# Altium schematic sheet Harvester.SchDoc
size A4
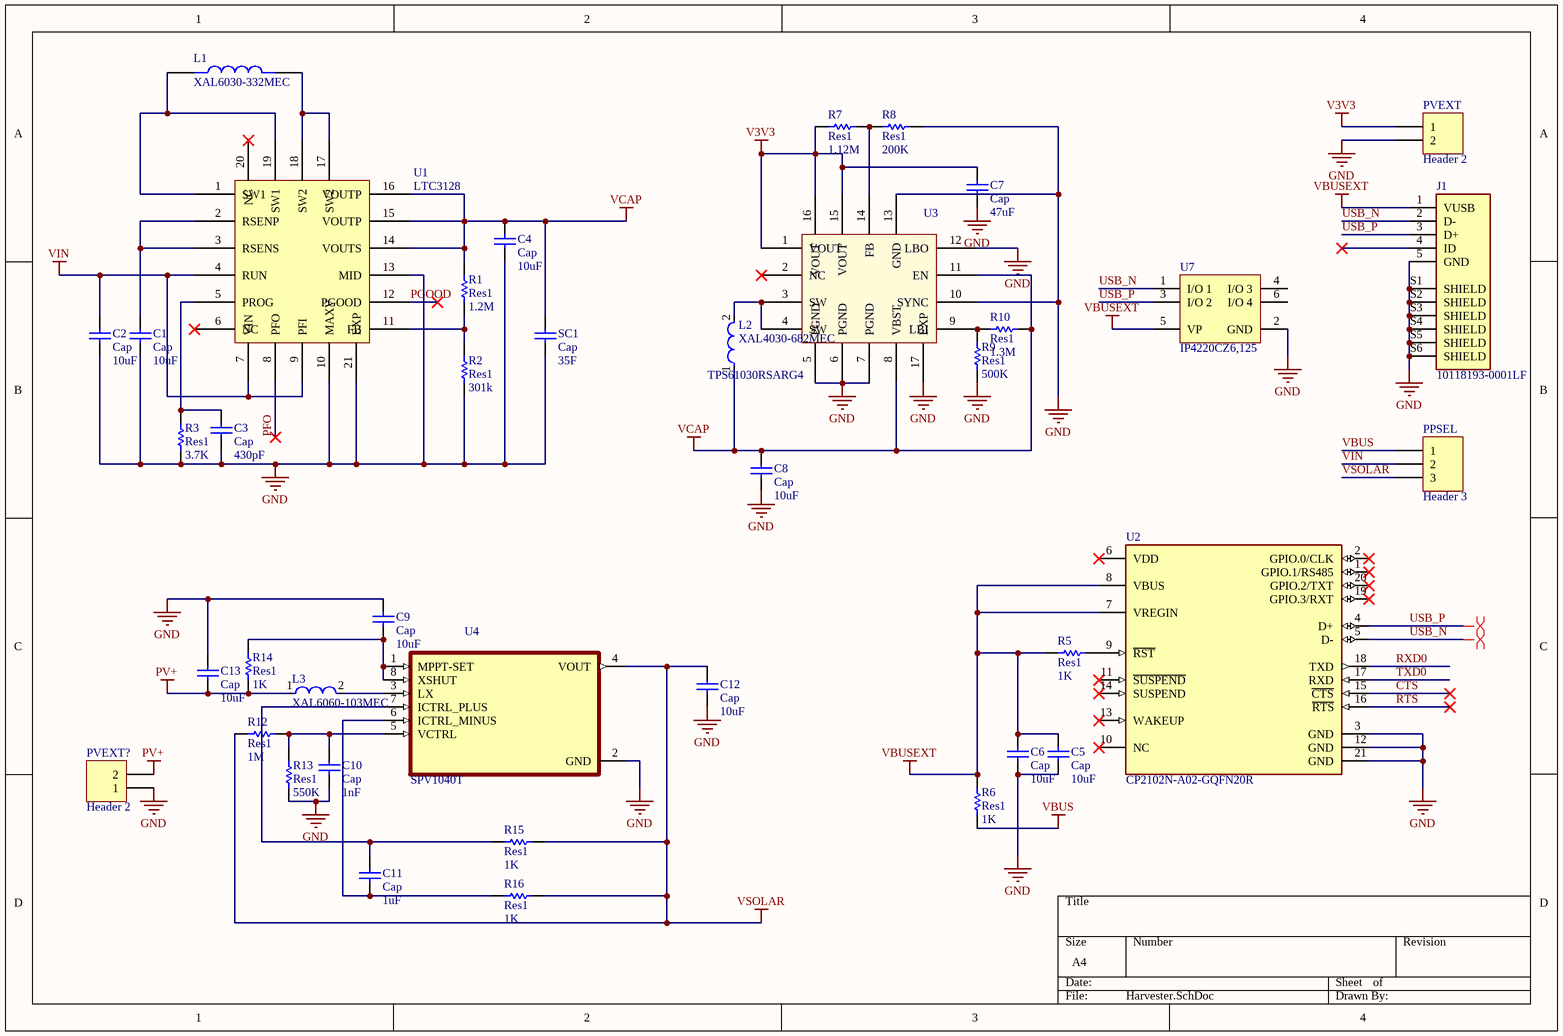
[diagram p0: Harvester.SchDoc]

## Parts
C1  Cap  value 10uF  [1608[0603]]
C2  Cap  value 10uF  [1608[0603]]
C3  Cap  value 430pF  [1608[0603]]
C4  Cap  value 10uF  [1608[0603]]
C5  Cap  value 10uF  [1608[0603]]
C6  Cap  value 10uF  [1608[0603]]
C7  Cap  value 47uF  [1812]
C8  Cap  value 10uF  [1608[0603]]
C9  Cap  value 10uF  [1608[0603]]
C10  Cap  value 1nF  [1608[0603]]
C11  Cap  value 1uF  [1608[0603]]
C12  Cap  value 10uF  [1608[0603]]
C13  Cap  value 10uF  [1608[0603]]
J1  10118193-0001LF  [FCI_10118193-0001LF]
L1  XAL6030-332MEC  [IND_XAL6030-332MEC]
L2  XAL4030-682MEC  [FP-XAL4030-472MEC-MFG]
L3  XAL6060-103MEC  [FP-XAL6060-103MEC-MFG]
PPSEL  Header 3  [HDR1X3]
PVEXT  Header 2  [HDR1X2]
PVEXT?  Header 2  [HDR1X2]
R1  Res1  value 1.2M  [0603R-GENERIC]
R2  Res1  value 301k  [0603R-GENERIC]
R3  Res1  value 3.7K  [0603R-GENERIC]
R5  Res1  value 1K  [0603R-GENERIC]
R6  Res1  value 1K  [0603R-GENERIC]
R7  Res1  value 1.12M  [0603R-GENERIC]
R8  Res1  value 200K  [0603R-GENERIC]
R9  Res1  value 500K  [0603R-GENERIC]
R10  Res1  value 1.3M  [0603R-GENERIC]
R12  Res1  value 1M  [0603R-GENERIC]
R13  Res1  value 550K  [0603R-GENERIC]
R14  Res1  value 1K  [0603R-GENERIC]
R15  Res1  value 1K  [0603R-GENERIC]
R16  Res1  value 1K  [0603R-GENERIC]
SC1  Cap  value 35F  [RAD-0.3]
U1  LTC3128  [QFN50P400X500X80-21N]
U2  CP2102N-A02-GQFN20R  [FP-CP2102N-A02-GQFN20R-MFG]
U3  TPS61030RSARG4  [QFN65P400X400X100-17N]
U4  SPV1040T  [SOP65P640X120-8N]
U7  IP4220CZ6,125  [NXP-SOT457_L]

## Nets
GND: C1.1 C2.1 C3.1 C4.1 C5.1 C6.1 C7.1 C8.1 C9.2 C10.1 C12.1 C13.2 J1.5(GND) J1.S1(SHIELD) J1.S2(SHIELD) J1.S3(SHIELD) J1.S4(SHIELD) J1.S5(SHIELD) J1.S6(SHIELD) PVEXT.2 PVEXT?.1 R2.2 R3.1 R8.1 R9.2 R13.1 SC1.1 U1.10(MAXV) U1.13(MID) U1.21(EXP) U2.3(GND) U2.12(GND) U2.21(GND) U3.5(PGND) U3.6(PGND) U3.7(PGND) U3.10(SYNC) U3.12(LBO) U3.13(GND) U3.17(EXP) U4.2(GND) U7.2(GND)
PV+: C13.1 L3.1 PVEXT?.2 R14.1
V3V3: C7.2 PVEXT.1 R7.2 U3.1(VOUT) U3.15(VOUT) U3.16(VOUT)
VBUS: PPSEL.1 R6.1
VBUSEXT: C5.2 C6.2 J1.1(VUSB) R5.2 R6.2 U2.7(VREGIN) U2.8(VBUS) U7.5(VP)
VCAP: C4.2 C8.2 L2.1 R1.2 R10.2 SC1.2 U1.14(VOUTS) U1.15(VOUTP) U1.16(VOUTP) U3.8(VBST) U3.11(EN)
VIN: C2.2 PPSEL.2 U1.4(RUN) U1.7(VIN) U1.9(PFI)
VSOLAR: C12.2 PPSEL.3 R12.2 R15.1 R16.1 U4.4(VOUT)
CTS: U2.15(~{CTS})
PFO: U1.8(PFO)
PGOOD: U1.12(PGOOD)
RTS: U2.16(~{RTS})
RXD0: U2.18(TXD)
TXD0: U2.17(RXD)
USB_N: J1.2(D-) U2.5(D-) U7.1(I/O_1)
USB_P: J1.3(D+) U2.4(D+) U7.3(I/O_2)
NetC1_2: C1.2 U1.2(RSENP) U1.3(RSENS)
NetC3_2: C3.2 R3.2 U1.5(PROG)
NetC9_1: C9.1 R14.2 U4.1(MPPT-SET) U4.8(XSHUT)
NetC10_2: C10.2 R12.1 R13.2 U4.5(VCTRL)
NetC11_1: C11.1 R16.2 U4.6(ICTRL_MINUS)
NetC11_2: C11.2 R15.2 U4.7(ICTRL_PLUS)
NetL1_1: L1.1 U1.1(SW1) U1.19(SW1)
NetL1_2: L1.2 U1.17(SW2) U1.18(SW2)
NetL2_2: L2.2 U3.3(SW) U3.4(SW)
NetL3_2: L3.2 U4.3(LX)
NetR1_1: R1.1 R2.1 U1.11(FB)
NetR5_1: R5.1 U2.9(~{RST})
NetR7_1: R7.1 R8.2 U3.14(FB)
NetR9_1: R9.1 R10.1 U3.9(LBI)

Not connected (* = marked no-connect by the designer): J1 4(ID)*; U1 6(NC)* 20(NC)*; U2 1(GPIO.1/RS485)* 2(GPIO.0/CLK)* 6(VDD)* 10(NC)* 11(~{SUSPEND})* 13(WAKEUP)* 14(SUSPEND)* 19(GPIO.3/RXT)* 20(GPIO.2/TXT)*; U3 2(NC)*; U7 4(I/O_3) 6(I/O_4)

## Layout directives
differential pair: USB_N, USB_P

## Library data of the parts
C1-C13 SC1 = Cap: Capacitor; Published: 8-Jun-2000; LatestRevisionDate: 17-Jul-2002; LatestRevisionNote: Re-released for DXP Platform.; PackageReference: RAD-0.3; Publisher: Altium Limited; PackageDescription: Radial Cap, Thru-Hole; 2 Leads; 0.3 in Pin Spacing
J1 = 10118193-0001LF: USB - micro B USB 2.0 Receptacle Connector 5 Position Surface Mount, Right Angle; Through Hole; MF: Amphenol ICC; Availability: Unavailable; SnapEDA_Link: https://www.snapeda.com/parts/10118193-0001LF/Amphenol%20FCI/view-part/2758989/?ref=snap; MP: 10118193-0001LF; Price: None; Value: *; Package: None
L1 = XAL6030-332MEC: Power inductor, shielded, 20% tol, SMT, RoHS, halogen f; Package: None; Price: None; Value: *; MP: XAL6030-332MEC; Availability: Unavailable
L2 = CMP-11268-000082-1: Power Inductor (SMD), 6.8 µH, 5.1 A, Shielded, 4.5 A, XAL40xx Series, 4mm x 4mm x 3.1mm; Tolerance: 20%; DC Resistance (DCR): 44.1mR; Inductance: 4.7uH; Saturation Current: 4.5A; Max DC Current: 5.1A; Self Resonant Frequency: 36MHz; Test Frequency: 100kHz; Core Material: Composite; REACH SVHC: No SVHC; Height: 3.1mm; Package Quantity: 500; Width: 4.3mm; Mount: Surface Mount; RoHS Compliant: Yes; Case/Package: SMD/SMT; Length: 4.3mm; Packaging: Tape and Reel; Max Operating Temperature: 125°C; Min Operating Temperature: -40°C; Series: XAL4030; Termination: SMD/SMT; Inductance Tolerance: 20%; Shielding: Shielded; RMS Current (Irms): 5.1A; Lead Free: Contains Lead
L3 = CMP-11268-000089-1: - - Výkonový Induktor (SMD), 10 µH, 7 A, Stínený, 7.6 A, Série XAL6060, 6,56mm x 6,36mm x 6,1mm; Core Material: Composite; Inductance Tolerance: 20%; Saturation Current: 7.6A; Shielding: Shielded; Max DC Current: 7A; Inductance: 10uH; Test Frequency: 100kHz; Self Resonant Frequency: 14MHz; DC Resistance (DCR): 29.82mR; Package Quantity: 250; Min Operating Temperature: -40°C; Height: 6.1mm; Tolerance: 20%; Termination: SMD/SMT; Width: 6.56mm; Case/Package: SMD/SMT; Series: XAL6060; RoHS Compliant: Yes; Lead Free: Contains Lead; Max Operating Temperature: 125°C; Packaging: Tape and Reel; REACH SVHC: No SVHC; Mount: Surface Mount; RMS Current (Irms): 7A; Length: 6.76mm
PPSEL = Header 3: Header, 3-Pin; LatestRevisionDate: 17-Jul-2002; LatestRevisionNote: Re-released for DXP Platform.; Publisher: Altium Limited
PVEXT PVEXT? = Header 2: Header, 2-Pin; LatestRevisionDate: 17-Jul-2002; LatestRevisionNote: Re-released for DXP Platform.; Publisher: Altium Limited
R1-R3 R5-R10 R12-R16 = Res1: Resistor; Published: 8-Jun-2000; LatestRevisionDate: 17-Jul-2002; LatestRevisionNote: Re-released for DXP Platform.; PackageReference: AXIAL-0.3; Publisher: Altium Limited; PackageDescription: Axial Device, Thru-Hole; 2 Leads; 0.3 in Pin Spacing
U2 = CMP-08107-000007-1: IC USB TO UART BRIDGE QFN20
U4 = SPV1040T: IC BATTERY CHARGER SOLAR 8TSSOP; MF: STMicroelectronics; Package: TSSOP-8 STMicroelectronics; Availability: Unavailable; Value: *; MP: SPV1040T; SnapEDA_Link: https://www.snapeda.com/parts/SPV1040T/STMicroelectronics/view-part/480076/?ref=snap; Price: None
U7 = CMP-2000-06457-1: Dual USB 2.0 integrated ESD protection, 0 to 5.5 V, -40 to 85 degC, 6-Pin TSOP (SOT457), RoHS, Tape and Reel; Manufacturer: NXP Semiconductors; Product Height (mm): 1mm; Rad Hardened: No; Package Version: 06-03-16, 03/2006; Product Length (mm): 3.1mm; VIN Max: 5.5V; Configuration: Quad; Suppressor Type: DiodeArrays; Number of Channels: 4; VF: 0.7V; Capacitance Value: 1.2pF; Product Depth (mm): 1.7mm; VIN Min: 0V; Leakage Current (Max): 0.1uA; ESD Protection Voltage: 8KV@ContactDisc; Direction Type: Uni-Directional; Manufacturer URL: http://www.nxp.com/; Package Reference: SOT457; Datasheet URL: http://cache.nxp.com/documents/data_sheet/IP4220CZ6.pdf; Operating Temperature Max Deg. C: 85C; Packaging: TapeandReel; Package Description: 6-Pin Thin Small Outline Package, Body 2.9 x 1.5 mm, Pitch 0.95 mm; PartNumber: IP4220CZ6; Mounting Technology: SurfaceMount; Working Voltage (Max): 5.5V; Operating Temperature Min Deg. C: -40C; Working Voltage: 5.5V; Package / Case: TSOP; Package URL: http://www.nxp.com/documents/outline_drawing/sot457_po.pdf; Leakage Current: 0.1uA; Pin Count: 6; Mounting Style: SurfaceMount; Datasheet Version: Rev. 5, 07/2011